# EAGLE design macron (EAGLE 6.5.0)
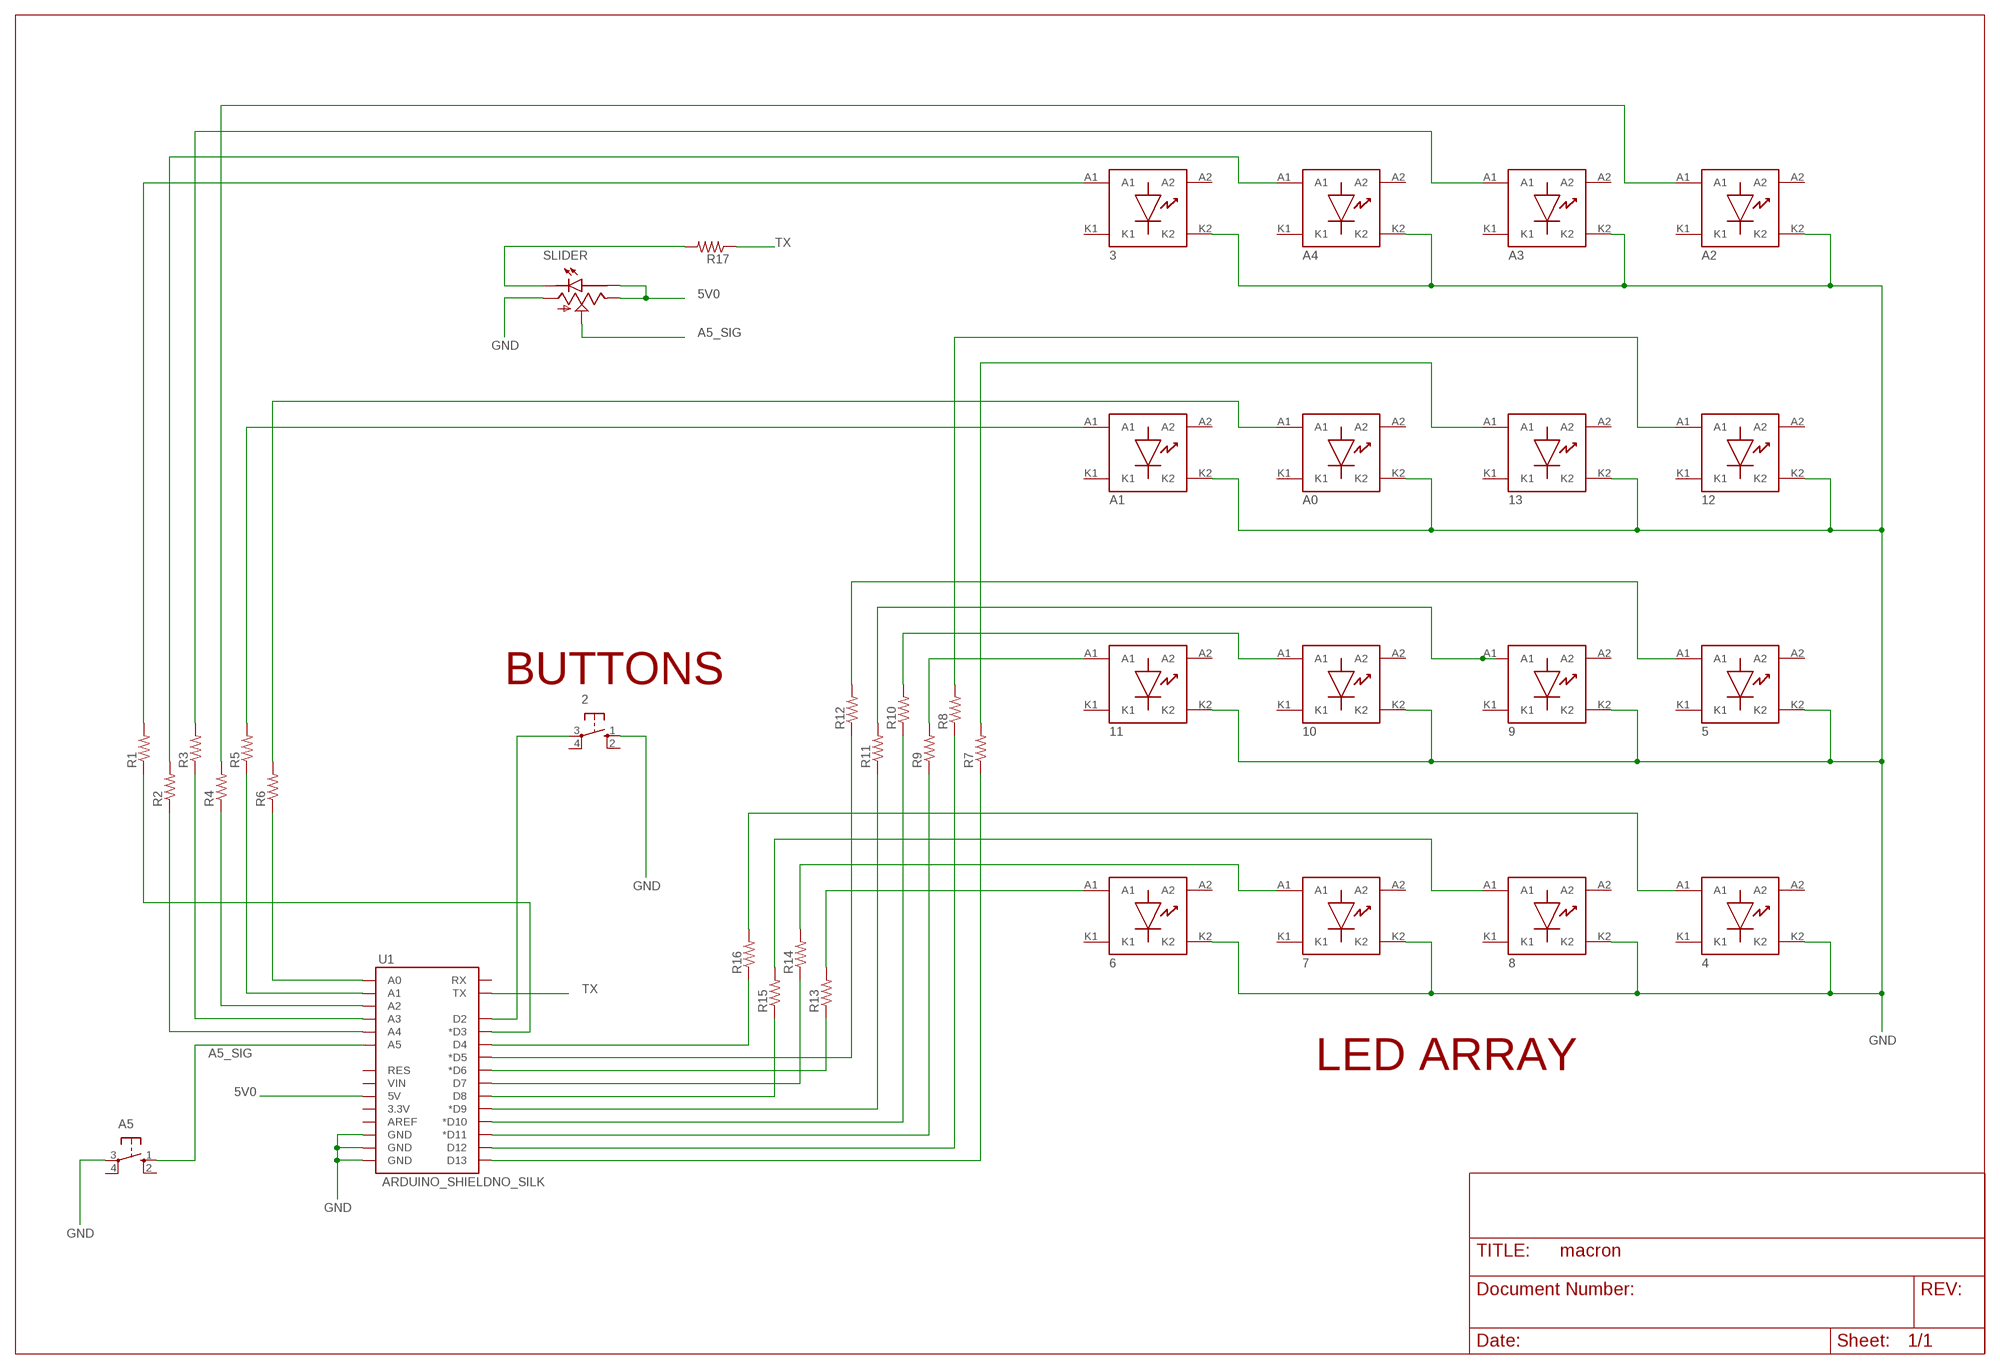
[diagram p0: schematic, sheet 1]

## Parts
2  10-XX  [B3F-10XX]
3  LED_SMT  [AVAGO-SMT-LED]
4  LED_SMT  [AVAGO-SMT-LED]
5  LED_SMT  [AVAGO-SMT-LED]
6  LED_SMT  [AVAGO-SMT-LED]
7  LED_SMT  [AVAGO-SMT-LED]
8  LED_SMT  [AVAGO-SMT-LED]
9  LED_SMT  [AVAGO-SMT-LED]
10  LED_SMT  [AVAGO-SMT-LED]
11  LED_SMT  [AVAGO-SMT-LED]
12  LED_SMT  [AVAGO-SMT-LED]
13  LED_SMT  [AVAGO-SMT-LED]
A0  LED_SMT  [AVAGO-SMT-LED]
A1  LED_SMT  [AVAGO-SMT-LED]
A2  LED_SMT  [AVAGO-SMT-LED]
A3  LED_SMT  [AVAGO-SMT-LED]
A4  LED_SMT  [AVAGO-SMT-LED]
A5  10-XX  [B3F-10XX]
R1  R-US_0204/7  [0204/7]
R2  R-US_0204/7  [0204/7]
R3  R-US_0204/7  [0204/7]
R4  R-US_0204/7  [0204/7]
R5  R-US_0204/7  [0204/7]
R6  R-US_0204/7  [0204/7]
R7  R-US_0204/7  [0204/7]
R8  R-US_0204/7  [0204/7]
R9  R-US_0204/7  [0204/7]
R10  R-US_0204/7  [0204/7]
R11  R-US_0204/7  [0204/7]
R12  R-US_0204/7  [0204/7]
R13  R-US_0204/7  [0204/7]
R14  R-US_0204/7  [0204/7]
R15  R-US_0204/7  [0204/7]
R16  R-US_0204/7  [0204/7]
R17  R-US_0204/7  [0204/7]
SLIDER  BOURNS_LED_SLIDER  [BOURNS_45MM_LED_SLIDE_POT]
U1  ARDUINO_SHIELDNO_SILK  [DUEMILANOVE_VIAS]

## Nets
5V0: SLIDER.HIGH_END(HIGH) SLIDER.LED+(A1) U1.5V
A5_SIG: A5.1(S) SLIDER.WIPER U1.A5
GND: 2.1(S) 3.K2 4.K2 5.K2 6.K2 7.K2 8.K2 9.K2 10.K2 11.K2 12.K2 13.K2 A0.K2 A1.K2 A2.K2 A3.K2 A4.K2 A5.3(P) SLIDER.LOW_END(LOW) U1.GND@0(GND) U1.GND@1(GND) U1.GND@2(GND)
N$1: R17.2 SLIDER.LED-(C)
N$2: 3.A1 R1.2
N$3: R2.1 U1.A4
N$4: A4.A1 R2.2
N$5: R3.1 U1.A3
N$6: A3.A1 R3.2
N$7: R4.1 U1.A2
N$8: A2.A1 R4.2
N$9: R5.1 U1.A1
N$10: R6.1 U1.A0
N$11: A1.A1 R5.2
N$12: A0.A1 R6.2
N$13: R7.1 U1.D13
N$14: R8.1 U1.D12
N$15: R9.1 U1.D11(*D11)
N$16: R10.1 U1.D10(*D10)
N$17: R11.1 U1.D9(*D9)
N$18: 13.A1 R7.2
N$19: 12.A1 R8.2
N$20: 11.A1 R9.2
N$21: 10.A1 R10.2
N$22: 9.A1 R11.2
N$23: R12.1 U1.D5(*D5)
N$24: R13.1 U1.D6(*D6)
N$25: R14.1 U1.D7
N$26: R15.1 U1.D8
N$27: R16.1 U1.D4
N$28: 5.A1 R12.2
N$29: 6.A1 R13.2
N$30: 7.A1 R14.2
N$31: 8.A1 R15.2
N$32: 4.A1 R16.2
N$34: 2.3(P) U1.D2
N$35: R1.1 U1.D3(*D3)
TX: R17.1 U1.TX
Unconnected: 2.2(S1) 2.4(P1) 3.A2 3.K1 4.A2 4.K1 5.A2 5.K1 6.A2 6.K1 7.A2 7.K1 8.A2 8.K1 9.A2 9.K1 10.A2 10.K1 11.A2 11.K1 12.A2 12.K1 13.A2 13.K1 A0.A2 A0.K1 A1.A2 A1.K1 A2.A2 A2.K1 A3.A2 A3.K1 A4.A2 A4.K1 A5.2(S1) A5.4(P1) U1.3.3V U1.AREF U1.RES U1.RX U1.VIN

## Notes on the sheet
- BUTTONS
- LED ARRAY

## Library data of the parts
2 A5 = switch-omron:10-XX: OMRON SWITCH; MPN: B3F-1000; OC_FARNELL: 176432; OC_NEWARK: 36M3542
3-13 A0 A1-A4 = led_avago_smt_joe:LED_SMT
R1-R17 = rcl:R-US_: RESISTOR, American symbol
SLIDER = pot_bourns_joe:BOURNS_LED_SLIDER
U1 = modified_sparkfun_joe:ARDUINO_SHIELD: Arduino shield footprint

## Board
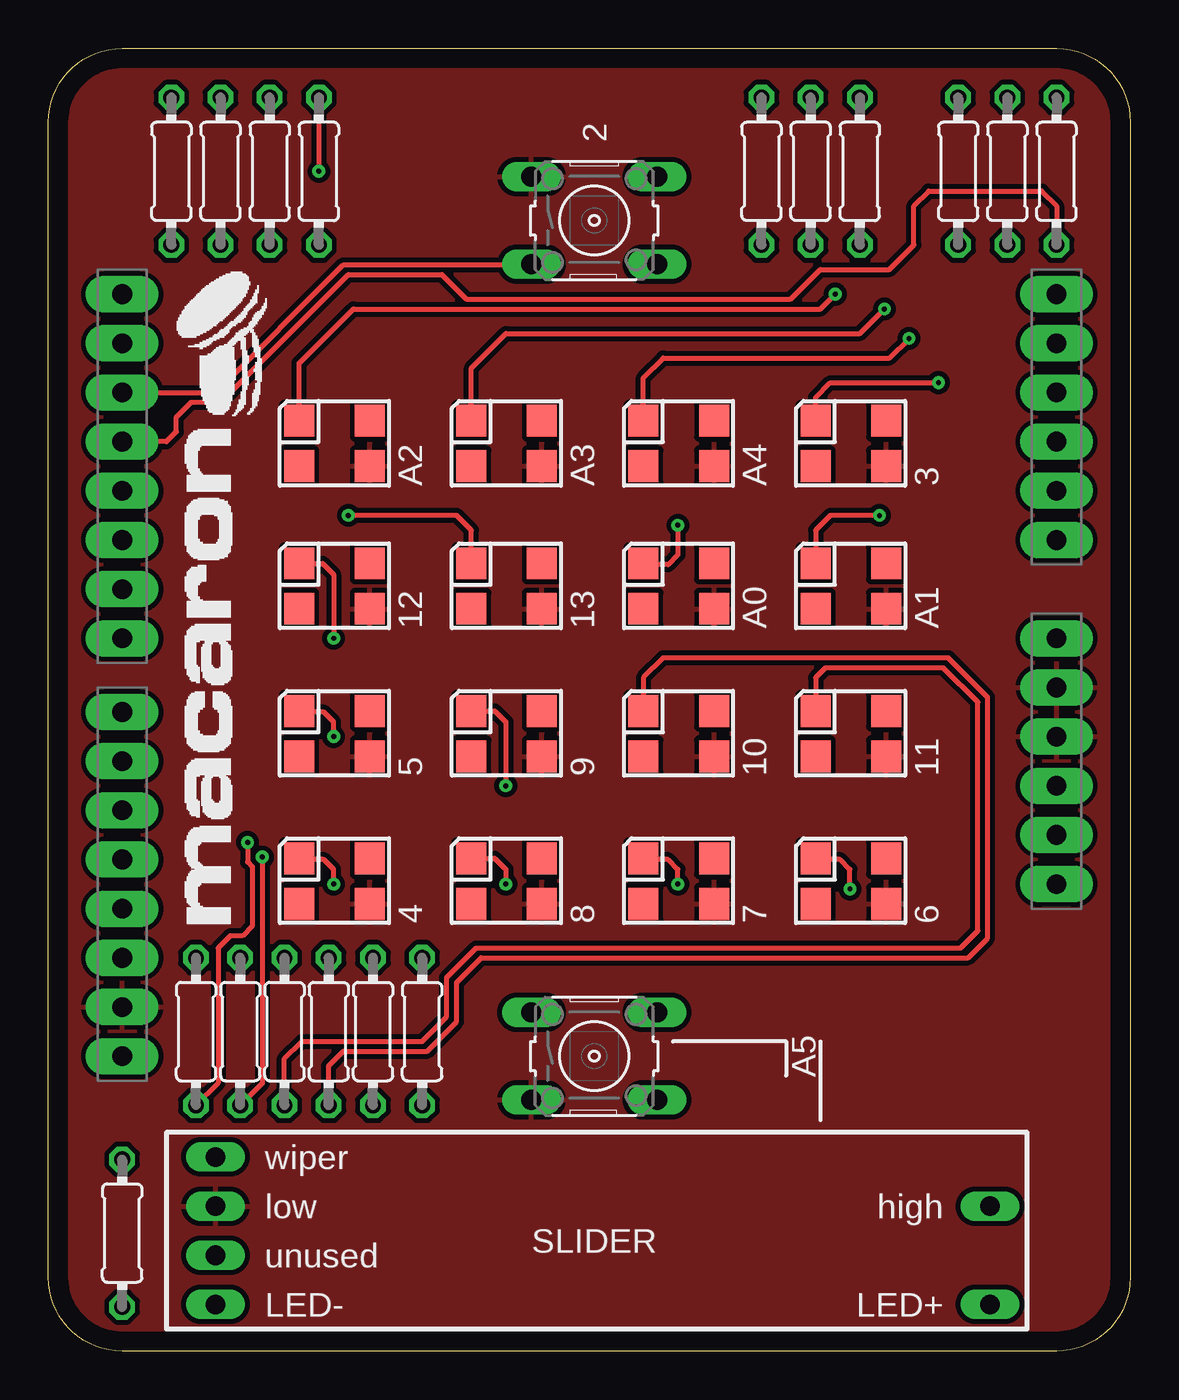
[diagram p1: board, top side]
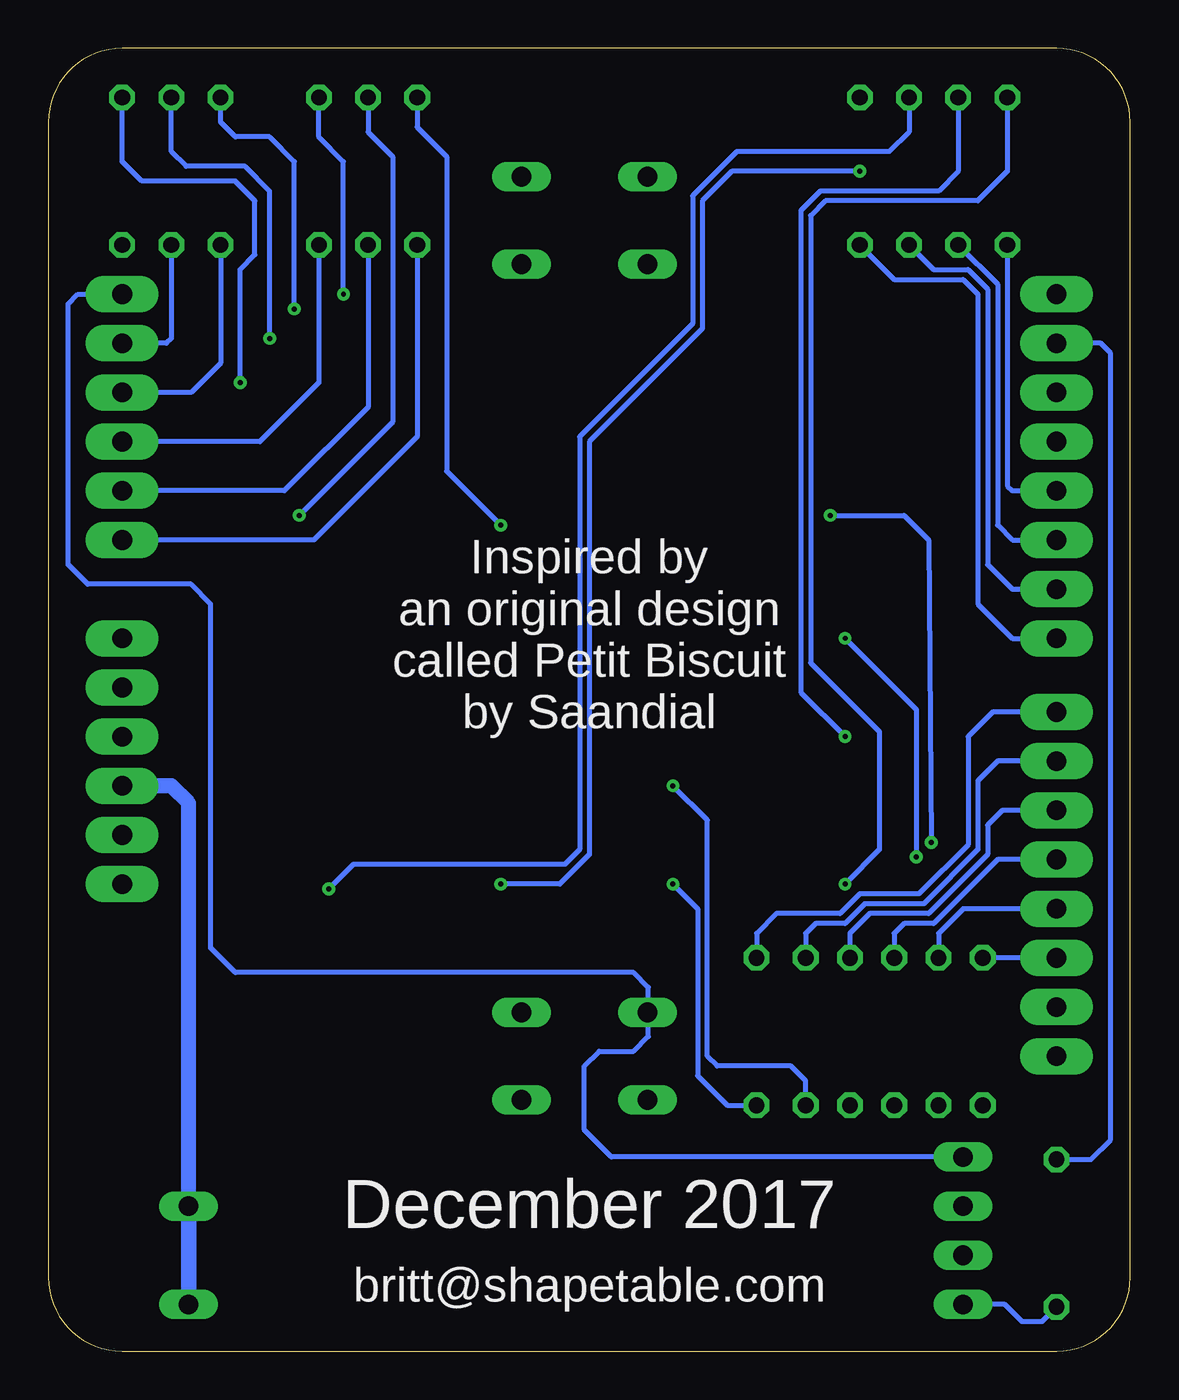
[diagram p2: board, bottom side, seen from below]

Size 55.88 x 67.31 mm. Coordinates in mm from the lower left corner, seen from the top.
Outline: 0,3.81 0,63.5 arc-90 3.81,67.31 52.07,67.31 arc-90 55.88,63.5 55.88,3.81 arc-90 52.07,0 3.81,0 arc-90 0,3.81
Copper layers (1*16): Top 0.035mm / dielectric 1.5mm / Bottom 0.035mm
Design rules "default *": minimum track width 10mil, minimum drill 10mil, track to track 8mil, track to pad 8mil, pad to pad 8mil, via to via 8mil, smd to smd 8mil, copper to edge 40mil, drill to drill 8mil, minimum pad ring 10mil, minimum via ring 8mil, stop-mask expansion 4mil, vias tented up to drill 10mil, thermal gap 10mil

### Footprints (pad centres in the part's own frame; a part is rotated, then mirrored left to right if it is on the bottom)
B3F-10XX = drill 1.016 long: 1 -3.251,2.261; 2 3.251,2.261; 3 -3.251,-2.261; 4 3.251,-2.261
AVAGO-SMT-LED = smd 1.55 x 1.65: A1 0,2.35; A2 3.65,2.35; K1 0,0; K2 3.65,0
0204/7 = drill 0.813 octagon: 1 -3.81,0; 2 3.81,0
BOURNS_45MM_LED_SLIDE_POT = drill 1.016 long: HIGH_END 40.005,5.08; LED+ 40.005,0; LED- 0,0; LOW_END 0,5.08; UNUSED 0,2.54; WIPER 0,7.62
DUEMILANOVE_VIAS = drill 1.016 pad 1.88 long: 3.3V 50.8,13.97; 5V 50.8,16.51; A0 50.8,29.21; A1 50.8,31.75; A2 50.8,34.29; A3 50.8,36.83; A4 50.8,39.37; A5 50.8,41.91; AREF 2.54,2.54; D2 2.54,36.83; D3 2.54,34.29; D4 2.54,31.75; D5 2.54,29.21; D6 2.54,26.67; D7 2.54,24.13; D8 2.54,20.32; D9 2.54,17.78; D10 2.54,15.24; D11 2.54,12.7; D12 2.54,10.16; D13 2.54,7.62; GND@0 50.8,19.05; GND@1 50.8,21.59; GND@2 2.54,5.08; RES 50.8,11.43; RX 2.54,41.91; TX 2.54,39.37; VIN 50.8,24.13

### Placement (x,y rotation side)
2  28.19,58.42 0 top
3  39.62,45.72 0 top
4  12.95,23.11 0 top
5  12.95,30.73 0 top
6  39.62,23.11 0 top
7  30.73,23.11 0 top
8  21.84,23.11 0 top
9  21.84,30.73 0 top
10  30.73,30.73 0 top
11  39.62,30.73 0 top
12  12.95,38.35 0 top
13  21.84,38.35 0 top
A0  30.73,38.35 0 top
A1  39.62,38.35 0 top
A2  12.95,45.72 0 top
A3  21.84,45.72 0 top
A4  30.73,45.72 0 top
A5  28.19,15.24 0 top
R1  52.07,60.96 90 top
R2  49.53,60.96 90 top
R3  46.99,60.96 90 top
R4  41.91,60.96 90 top
R5  39.37,60.96 90 top
R6  36.83,60.96 90 top
R7  7.62,16.51 270 top
R8  9.91,16.51 270 top
R9  12.19,16.51 270 top
R10  14.48,16.51 270 top
R11  16.76,16.51 270 top
R12  8.89,60.96 90 top
R13  11.43,60.96 90 top
R14  13.97,60.96 90 top
R15  19.3,16.51 270 top
R16  6.35,60.96 90 top
R17  3.81,6.1 270 top
SLIDER  8.64,2.41 0 top
U1  1.27,12.7 0 top

### Tracks (layer width: path | path; a pad name or v marks a point on that pad's centre or on a via)
5V0
  Bottom 0.762: SLIDER.HIGH_END 48.64,28.32 49.53,29.21 U1.5V
  Bottom 0.813: SLIDER.HIGH_END SLIDER.LED+
A5_SIG
  Bottom 0.254: SLIDER.WIPER 26.8,10.03 28.19,11.43 28.19,14.73 27.43,15.49 25.65,15.49 24.89,16.26 24.89,17.27 | U1.A5 54.36,54.61 54.86,54.1 54.86,40.64 53.85,39.62 48.51,39.62 47.5,38.61 47.5,20.83 46.23,19.56 25.65,19.56 24.89,18.8 24.89,17.27 | A5.1 24.89,17.27
GND
  pour Top (isolate 0.254): 0,3.81 0,63.5 arc-90 3.81,67.31 52.07,67.31 arc-90 55.88,63.5 55.88,3.81 arc-90 52.07,0 3.81,0 arc-90
N$1
  Bottom 0.254: R17.2 4.57,1.52 5.59,1.52 6.48,2.41 SLIDER.LED-
N$2  (via drill 0.25 pad 0.25)
  Top 0.254: 3.A1 39.62,49.28 40.39,50.04 v45.97,50.04
  Bottom 0.254: v45.97,50.04 45.97,55.88 45.21,56.64 45.21,59.44 46.23,60.45 51.05,60.45 52.07,61.47 R1.2
N$3
  Bottom 0.254: R2.1 49.53,52.32 49.78,52.07 U1.A4
N$4  (via drill 0.25 pad 0.25)
  Top 0.254: A4.A1 30.73,50.29 31.75,51.31 43.43,51.31 v44.45,52.32
  Bottom 0.254: v44.45,52.32 44.45,59.94 45.72,61.21 48.77,61.21 49.53,61.98 R2.2
N$5
  Bottom 0.254: R3.1 46.99,51.05 48.51,49.53 U1.A3
N$6  (via drill 0.25 pad 0.25)
  Top 0.254: A3.A1 21.84,50.8 23.62,52.58 41.91,52.58 v43.18,53.85
  Bottom 0.254: v43.18,53.85 43.18,61.47 44.45,62.74 46.23,62.74 46.99,63.5 R3.2
N$7
  Bottom 0.254: R4.1 41.91,50.04 44.96,46.99 U1.A2
N$8  (via drill 0.25 pad 0.25)
  Top 0.254: A2.A1 12.95,51.05 15.75,53.85 39.88,53.85 v40.64,54.61
  Bottom 0.254: v40.64,54.61 40.64,61.47 41.91,62.74 R4.2
N$9
  Bottom 0.254: R5.1 39.37,48.77 43.69,44.45 U1.A1
N$10
  Bottom 0.254: R6.1 36.83,47.24 42.16,41.91 U1.A0
N$11  (via drill 0.25 pad 0.25)
  Top 0.254: v42.93,43.18 40.39,43.18 39.62,42.42 A1.A1
  Bottom 0.254: R5.2 39.37,62.99 38.1,61.72 38.1,48.01 v42.93,43.18
N$12  (via drill 0.25 pad 0.25)
  Top 0.254: v32.51,42.67 32.51,41.15 32,40.64 30.8,40.64 A0.A1
  Bottom 0.254: R6.2 36.83,63.25 35.31,61.72 35.31,45.47 v32.51,42.67
N$13
  Bottom 0.254: U1.D13 R7.1
N$14
  Bottom 0.254: U1.D12 8.64,22.86 9.91,21.59 R8.1
N$15
  Bottom 0.254: U1.D11 6.86,25.4 10.16,22.1 11.68,22.1 12.19,21.59 R9.1
N$16
  Bottom 0.254: U1.D10 6.6,27.94 7.37,27.18 7.37,25.65 10.41,22.61 13.46,22.61 14.48,21.59 R10.1
N$17
  Bottom 0.254: U1.D9 6.86,30.48 7.87,29.46 7.87,25.91 10.67,23.11 13.72,23.11 14.73,22.1 16.26,22.1 16.76,21.59 R11.1
N$18  (via drill 0.25)
  Top 0.254: 13.A1 21.84,42.42 21.08,43.18 v15.49,43.18 | v10.29,26.29 10.29,25.27 10.54,25.02 10.54,21.97 10.03,21.46 9.4,21.46 8.76,20.83 8.76,13.84 R7.2
  Bottom 0.254: v15.49,43.18 11.68,43.18 10.41,41.91 v10.29,26.29
N$19  (via drill 0.25)
  Top 0.254: 12.A1 14.16,40.7 14.73,40.13 v14.73,36.83 | v11.05,25.53 11.05,13.84 R8.2
  Bottom 0.254: v14.73,36.83 11.05,33.15 v11.05,25.53
N$20
  Top 0.254: 11.A1 39.62,34.8 40.13,35.31 46.23,35.31 48.01,33.53 48.01,21.72 47.12,20.83 22.1,20.83 20.57,19.3 20.57,17.27 19.3,16 13.08,16 12.19,15.11 R9.2
N$21
  Top 0.254: 10.A1 30.73,34.8 31.75,35.81 46.48,35.81 48.51,33.78 48.51,21.34 47.5,20.32 22.35,20.32 21.08,19.05 21.08,17.02 19.56,15.49 15.24,15.49 14.48,14.73 R10.2
N$22  (via drill 0.25 pad 0.25)
  Top 0.254: 9.A1 23.05,33.08 23.62,32.51 v23.62,29.21
  Bottom 0.254: R11.2 16.76,13.97 17.53,14.73 21.34,14.73 21.84,15.24 21.84,27.43 v23.62,29.21
N$23
  Bottom 0.254: R12.1 6.86,55.12 6.86,42.67 6.1,41.91 U1.D5
N$24
  Bottom 0.254: R13.1 10.16,55.88 8.38,55.88 7.37,54.86 7.37,40.64 6.1,39.37 U1.D6
N$25
  Bottom 0.254: R14.1 12.19,55.37 8.64,55.37 7.87,54.61 7.87,38.61 6.1,36.83 U1.D7
N$26
  Bottom 0.254: U1.D8 7.11,33.02 8.38,31.75 8.38,26.16 10.92,23.62 13.97,23.62 14.99,22.61 18.29,22.61 19.3,21.59 R15.1
N$27
  Bottom 0.254: R16.1 6.35,44.7 6.1,44.45 U1.D4
N$28  (via drill 0.25 pad 0.25)
  Top 0.254: v14.73,31.75 14.73,32.51 14.22,33.02 13.02,33.02 5.A1
  Bottom 0.254: R12.2 8.89,60.96 9.91,59.94 16,59.94 17.02,58.93 17.02,34.04 v14.73,31.75
N$29  (via drill 0.25 pad 0.25)
  Top 0.254: v41.4,23.88 41.4,24.89 40.89,25.4 39.69,25.4 6.A1
  Bottom 0.254: R13.2 11.43,62.99 12.45,61.98 20.32,61.98 22.61,59.69 22.61,53.09 28.45,47.24 28.45,25.91 29.21,25.15 40.13,25.15 v41.4,23.88
N$30  (via drill 0.25 pad 0.25)
  Top 0.254: R14.2 v13.97,60.96 | v32.51,24.13 32.51,24.89 32,25.4 30.8,25.4 7.A1
  Bottom 0.254: v13.97,60.96 20.57,60.96 22.1,59.44 22.1,52.83 27.94,46.99 27.94,25.65 29.46,24.13 v32.51,24.13
N$31  (via drill 0.25 pad 0.25)
  Top 0.254: 8.A1 23.05,25.46 23.62,24.89 v23.62,24.13
  Bottom 0.254: v23.62,24.13 22.35,22.86 22.35,14.22 20.83,12.7 R15.2
N$32  (via drill 0.25 pad 0.25)
  Top 0.254: v14.73,24.13 14.73,24.89 14.22,25.4 13.02,25.4 4.A1
  Bottom 0.254: R16.2 6.35,60.96 7.87,59.44 15.75,59.44 16.51,58.67 16.51,35.56 12.95,32 12.95,25.91 v14.73,24.13
N$34
  Top 0.254: U1.D2 8.64,49.53 15.24,56.13 24.92,56.13 2.3
N$35
  Top 0.254: U1.D3 6.1,46.99 6.6,47.5 6.6,48.26 7.37,49.02 8.89,49.02 15.49,55.63 20.32,55.63 21.59,54.36 38.35,54.36 39.88,55.88 43.43,55.88 44.7,57.15 44.7,59.18 45.47,59.94 51.31,59.94 52.07,59.18 R1.1
TX
  Bottom 0.254: R17.1 2.03,9.91 1.02,10.92 1.02,51.56 1.52,52.07 U1.TX

### Text on the board
bPlace: Inspired by / an original design / called Petit Biscuit / by Saandial | December 2017 | britt@shapetable.com